# Altium project QiWirelessTransmitter.PrjPcb
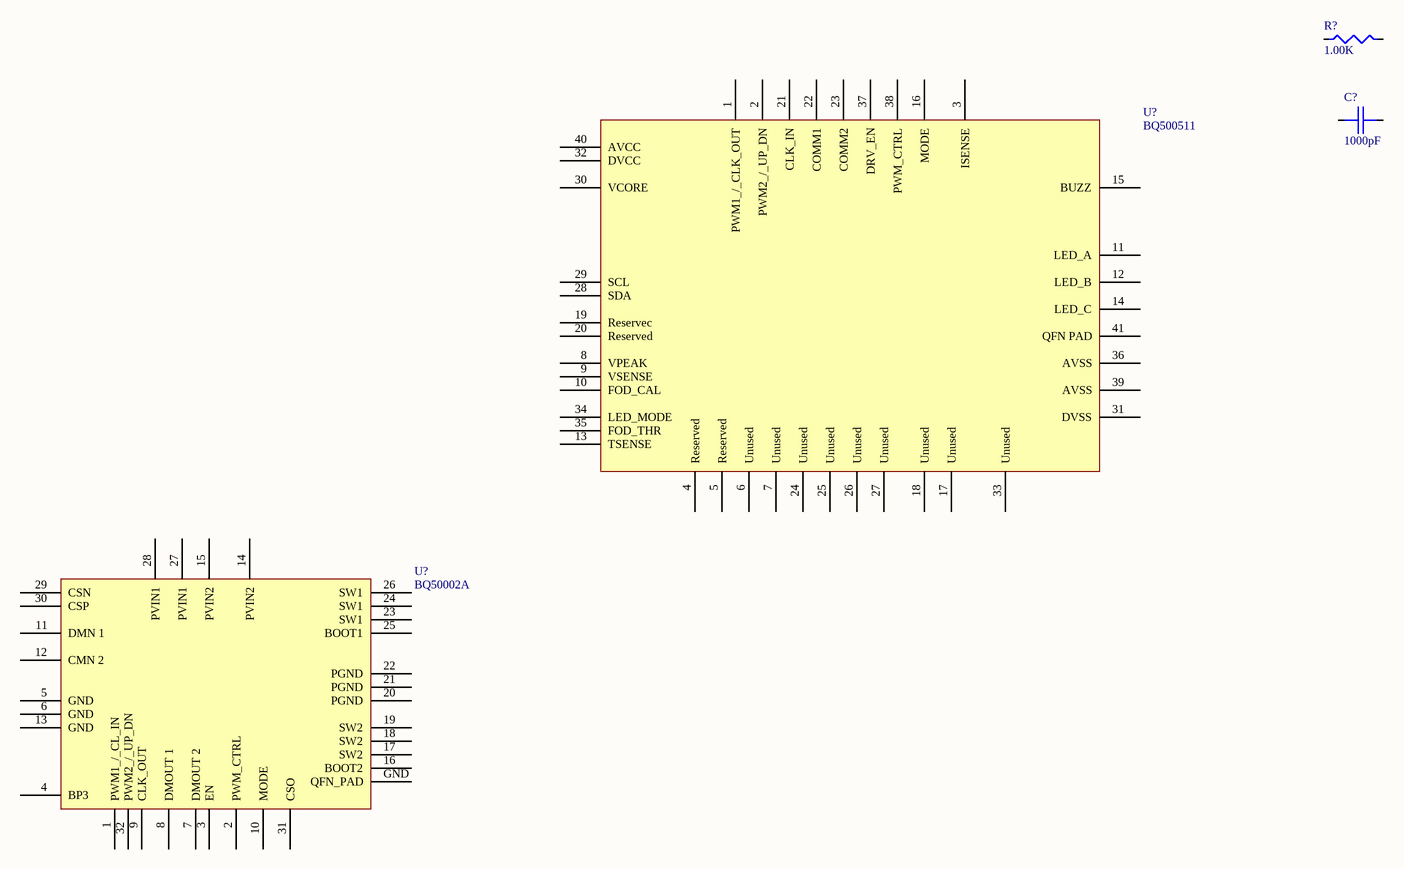
[diagram p0: qiwirelesstransmitterschdoc.SchDoc]
1 sheet, 4 parts. Net scope: global (net labels, ports and power ports of the same name join across sheets).
Board file: qiwirelesstransmitterpcbdoc.PcbDoc

## Sheet qiwirelesstransmitterschdoc.SchDoc
size E; Organization: Altium Limited; Address1: L3, 12a Rodborough Rd; Address2: Frenchs Forest; Address3: NSW; Address4: Australia 2086

### Parts
(Parts that share a designator on the sheet are numbered #1, #2 ... from top to bottom, then left to right.)
C?  1000pF  [C0805 0.94H]
R?  1.00K
U?#1  BQ500511  [bq500511]
U?#2  BQ50002A  [bq50002a]

### Nets

Not connected (* = marked no-connect by the designer): C? 1 2; R? 84 85; U?#1 1(PWM1_/_CLK_OUT) 2(PWM2_/_UP_DN) 3(ISENSE) 4(Reserved) 5(Reserved) 6(Unused) 7(Unused) 8(VPEAK) 9(VSENSE) 10(FOD_CAL) 11(LED_A) 12(LED_B) 13(TSENSE) 14(LED_C) 15(BUZZ) 16(MODE) 17(Unused) 18(Unused) 19(Reservec) 20(Reserved) 21(CLK_IN) 22(COMM1) 23(COMM2) 24(Unused) 25(Unused) 26(Unused) 27(Unused) 28(SDA) 29(SCL) 30(VCORE) 31(DVSS) 32(DVCC) 33(Unused) 34(LED_MODE) 35(FOD_THR) 36(AVSS) 37(DRV_EN) 38(PWM_CTRL) 39(AVSS) 40(AVCC) 41(QFN_PAD); U?#2 1(PWM1_/_CL_IN) 2(PWM_CTRL) 3(EN) 4(BP3) 5(GND) 6(GND) 7(DMOUT_2) 8(DMOUT_1) 9(CLK_OUT) 10(MODE) 11(DMN_1) 12(CMN_2) 13(GND) 14(PVIN2) 15(PVIN2) 16(BOOT2) 17(SW2) 18(SW2) 19(SW2) 20(PGND) 21(PGND) 22(PGND) 23(SW1) 24(SW1) 25(BOOT1) 26(SW1) 27(PVIN1) 28(PVIN1) 29(CSN) 30(CSP) 31(CSO) 32(PWM2_/_UP_DN) GND(QFN_PAD)

### Notes on the sheet
- Title
- Size:
- Date:
- File:
- E
- Number:
- Time:
- Revision:
- Sheet
- of

### Library data of the parts
C? = 08051C102KAT2A: CAP CER 1000PF 100V X7R 0805; Manufacturer: Kyocera AVX; Capacitance: 1nF; Tolerance: 10%; Dissipation Factor: 2.5%; Supplier 1: Mouser; Manufacturer Part Number: 08051C102KAT2A; RoHS: Yes; Category: Ceramic Capacitors; Stock 1: 83991; Pricing 1: 1=0.15000, 10=0.10600, 100=0.05200, 500=0.03700, 1000=0.03000, 2000=0.02800 (USD); Mount: Surface Mount; Case/Package: 0805; Number of Pins: 2; Case Code (Metric): 2012; Case Code (Imperial): 0805; Contact Plating: Tin,Matte; Min Operating Temperature: -55°C; Max Operating Temperature: 125°C; Packaging: Tape and Reel; Voltage Rating: 100V; Package Quantity: 1; Voltage Rating (DC): 100V; Dielectric: X7R; Termination: SMD/SMT; Voltage: 100V; Length: 2.01mm; Height: 0.94mm; Width: 0.049inch; Thickness: 0.037inch; Depth: 1.25mm; Radiation Hardening: No; REACH SVHC: No SVHC; Lead Free: Lead Free; ComponentLink1URL: https://datasheet.ciiva.com/11786/0900766b80ed4be2-11786533.pdf?src-supplier=RSComponents; ComponentLink1Description: https://datasheet.ciiva.com/11786/0900766b80ed4be2-11786533.pdf?src-supplier=RSComponents; ComponentLink2URL: https://datasheet.ciiva.com/22683/1679506-22683368.pdf?src-supplier=Element14; ComponentLink2Description: https://datasheet.ciiva.com/22683/1679506-22683368.pdf?src-supplier=Element14; ComponentLink3URL: https://datasheet.ciiva.com/2987/cx7r-2987930.pdf?src-supplier=Avnet; ComponentLink3Description: https://datasheet.ciiva.com/2987/cx7r-2987930.pdf?src-supplier=Avnet; ComponentLink4URL: https://datasheet.ciiva.com/7811/cx7r-7811914.pdf?src-supplier=Element14; ComponentLink4Description: https://datasheet.ciiva.com/7811/cx7r-7811914.pdf?src-supplier=Element14; ComponentLink5URL: https://datasheet.ciiva.com/150/cx7r-150587.pdf?src-supplier=Digi-Key; ComponentLink5Description: https://datasheet.ciiva.com/150/cx7r-150587.pdf?src-supplier=Digi-Key; ComponentLink6URL: https://datasheet.ciiva.com/150/cx7r-150588.pdf?src-supplier=Digi-Key; ComponentLink6Description: https://datasheet.ciiva.com/150/cx7r-150588.pdf?src-supplier=Digi-Key; ComponentLink7URL: https://datasheet.ciiva.com/22699/1679506-22699612.pdf?src-supplier=Element14; ComponentLink7Description: https://datasheet.ciiva.com/22699/1679506-22699612.pdf?src-supplier=Element14; ComponentLink8URL: https://datasheet.ciiva.com/150/cx7r-150589.pdf?src-supplier=Digi-Key; ComponentLink8Description: https://datasheet.ciiva.com/150/cx7r-150589.pdf?src-supplier=Digi-Key; ComponentLink9URL: https://datasheet.ciiva.com/5420/cx7r-218113-5420893.pdf?src-supplier=Mouser; ComponentLink9Description: https://datasheet.ciiva.com/5420/cx7r-218113-5420893.pdf?src-supplier=Mouser; Supplier Part Number 1: 581-08051C102K
R? = RT0805BRE071KL: Res Thin Film 0805 1K Ohm 0.1% 0.125W(1/8W) ±50ppm/C Molded SMD Paper T/R; Manufacturer: Yageo; Resistance: 1kR; Temperature Coefficient: 50ppm/°C; Power Rating: 125mW; Voltage Rating (DC): 150V; Supplier 1: Mouser; Manufacturer Part Number: RT0805BRE071KL; RoHS: Yes; Category: Chip SMD Resistors; Stock 1: 2152; Pricing 1: 1=0.54000, 10=0.31400, 100=0.12500, 1000=0.08900, 5000=0.07300, 10000=0.07100 (USD); Case/Package: 0805; Contact Plating: Tin,Matte; Case Code (Metric): 2012; Case Code (Imperial): 0805; Min Operating Temperature: -55°C; Max Operating Temperature: 125°C; Tolerance: 0.1%; Packaging: Tape and Reel; Composition: Thin Film; Number of Terminations: 2; Package Quantity: 5000; Max Power Dissipation: 125mW; Military Standard: Not; Features: Moisture Resistant; Length: 0.079inch; Height: 0.024inch; Width: 0.049inch; Depth: 1.25mm; Radiation Hardening: No; Lead Free: Lead Free; ComponentLink1URL: http://components.arrow.com/part/dataview/0323_00047443?src-supplier=Arrow+Europe; ComponentLink1Description: http://components.arrow.com/part/dataview/0323_00047443?src-supplier=Arrow+Europe; ComponentLink2URL: http://www.yageo.com/documents/recent/PYu-RT_1-to-0.01_RoHS_L_7.pdf?src-supplier=Digi-Key; ComponentLink2Description: http://www.yageo.com/documents/recent/PYu-RT_1-to-0.01_RoHS_L_7.pdf?src-supplier=Digi-Key; ComponentLink3URL: http://www.yageo.com/documents/recent/PYu-RT_1-to-0.05_RoHS_L_6.pdf?src-supplier=Avnet; ComponentLink3Description: http://www.yageo.com/documents/recent/PYu-RT_1-to-0.05_RoHS_L_6.pdf?src-supplier=Avnet; ComponentLink4URL: http://www.yageo.com/documents/recent/PYu-RT_1-to-0.05_RoHS_L_(4).pdf?src-supplier=Avnet+Europe; ComponentLink4Description: http://www.yageo.com/documents/recent/PYu-RT_1-to-0.05_RoHS_L_(4).pdf?src-supplier=Avnet+Europe; ComponentLink5URL: http://www.yageo.com/documents/recent/PYu-RT_1-to-0.05_RoHS_L_(4).pdf?src-supplier=Future+Electronics; ComponentLink5Description: http://www.yageo.com/documents/recent/PYu-RT_1-to-0.05_RoHS_L_(4).pdf?src-supplier=Future+Electronics; ComponentLink6URL: http://www.yageo.com/documents/recent/PYu-RT_1-to-0.01_RoHS_L_9.pdf?src-supplier=Digi-Key; ComponentLink6Description: http://www.yageo.com/documents/recent/PYu-RT_1-to-0.01_RoHS_L_9.pdf?src-supplier=Digi-Key; Supplier Part Number 1: 603-RT0805BRE071KL
U?#1 = BQ500511RHAT: IC WIRELESS TRANSMITTER 40VQFN; Manufacturer: Texas Instruments; Operating Supply Current: 3.45mA; Min Supply Voltage: 2V; Max Supply Voltage: 3.6V; Supplier 1: Mouser; Manufacturer Part Number: BQ500511RHAT; RoHS: Yes; Category: Power Management ICs; Stock 1: 391; Pricing 1: 1=5.17000, 10=4.65000, 100=3.80000, 250=3.57000, 500=3.24000, 1000=2.73000 (USD); Mount: Surface Mount; Case/Package: VQFN; Number of Pins: 40; Contact Plating: Gold; Min Operating Temperature: -40°C; Max Operating Temperature: 85°C; Packaging: Cut Tape; Lead Free: Lead Free; REACH SVHC: No SVHC; ComponentLink1URL: http://www.ti.com/general/docs/lit/getliterature.tsp?genericPartNumber=BQ500511&amp;&amp;fileType=pdf&src-supplier=Farnell; ComponentLink1Description: http://www.ti.com/general/docs/lit/getliterature.tsp?genericPartNumber=BQ500511&amp;&amp;fileType=pdf&src-supplier=Farnell; ComponentLink2URL: http://www.ti.com/general/docs/lit/getliterature.tsp?genericPartNumber=BQ500511&&fileType=pdf&src-supplier=Avnet; ComponentLink2Description: http://www.ti.com/general/docs/lit/getliterature.tsp?genericPartNumber=BQ500511&&fileType=pdf&src-supplier=Avnet; ComponentLink3URL: http://www.ti.com/general/docs/lit/getliterature.tsp?genericPartNumber=BQ500511&&fileType=pdf&src-supplier=Element14; ComponentLink3Description: http://www.ti.com/general/docs/lit/getliterature.tsp?genericPartNumber=BQ500511&&fileType=pdf&src-supplier=Element14; ComponentLink4URL: http://www.ti.com/lit/ds/symlink/bq500511.pdf?src-supplier=Digi-Key; ComponentLink4Description: http://www.ti.com/lit/ds/symlink/bq500511.pdf?src-supplier=Digi-Key; ComponentLink5URL: http://www.ti.com/general/docs/lit/getliterature.tsp?genericPartNumber=BQ500511&&fileType=pdf&src-supplier=Farnell; ComponentLink5Description: http://www.ti.com/general/docs/lit/getliterature.tsp?genericPartNumber=BQ500511&&fileType=pdf&src-supplier=Farnell; Supplier Part Number 1: 595-BQ500511RHAT
U?#2 = BQ50002ARHBT: TEXAS INSTRUMENTS - BQ50002ARHBT - WIRELESS POWER TRANSMITTER AFE, VQFN-32; Supplier 1: Mouser; Manufacturer: Texas Instruments; Manufacturer Part Number: BQ50002ARHBT; RoHS: No; Category: Power Management ICs; Pricing 1: 1=2.87000, 10=2.44000, 100=1.95000, 500=1.71000, 1000=1.42000, 2500=1.32000 (USD); Lead Free: Lead Free; ComponentLink1URL: http://www.ti.com/general/docs/lit/getliterature.tsp?genericPartNumber=BQ50002A&fileType=pdf&src-supplier=Farnell; ComponentLink1Description: http://www.ti.com/general/docs/lit/getliterature.tsp?genericPartNumber=BQ50002A&fileType=pdf&src-supplier=Farnell; ComponentLink2URL: http://www.ti.com/lit/ds/symlink/bq50002a.pdf?src-supplier=Digi-Key; ComponentLink2Description: http://www.ti.com/lit/ds/symlink/bq50002a.pdf?src-supplier=Digi-Key; Supplier Part Number 1: 595-BQ50002ARHBT